# Altium project POW_HugoHamblok_Final.PrjPcb
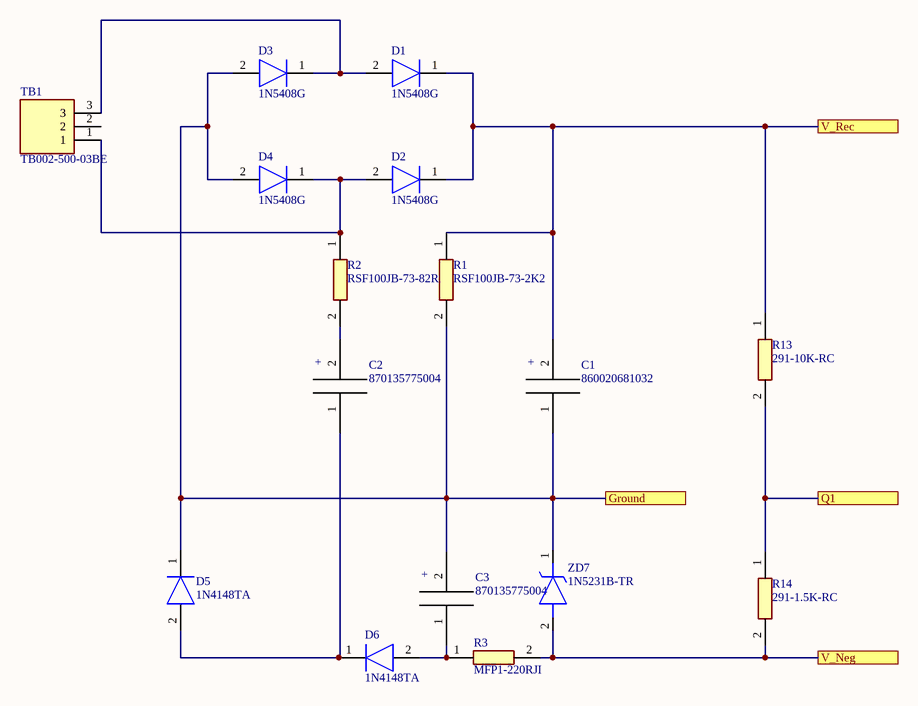
[diagram p0: POW_Schematic1.SchDoc]
4 sheets, 55 parts. Net scope: flat (ports and power ports of the same name join across sheets).
Board file: POW_PCB.PcbDoc
Sheets:
  POW_Schematic1.SchDoc
  POW_Schematic2.SchDoc
  POW_Schematic3.SchDoc
  POW_Schematic4.SchDoc

## Sheet POW_Schematic1.SchDoc
size A4

### Parts
C1  860020681032  [860020681032]
C2  870135775004  [870135775004]
C3  870135775004  [870135775004]
D1  1N5408G  [DIOAD2860W130L840D505]
D2  1N5408G  [DIOAD2860W130L840D505]
D3  1N5408G  [DIOAD2860W130L840D505]
D4  1N5408G  [DIOAD2860W130L840D505]
D5  1N4148TA  [DIOAD1068W53L380D172]
D6  1N4148TA  [DIOAD1068W53L380D172]
R1  RSF100JB-73-2K2  [RSF100 Style Footprint]
R2  RSF100JB-73-82R  [RSF100 Style Footprint]
R3  MFP1-220RJI  [MFP1-220RJI]
R13  291-10K-RC  [291-XXX-RC-Type]
R14  291-1.5K-RC  [291-XXX-RC-Type]
TB1  TB002-500-03BE  [SHDR3W100P0X500_1X3_1500X760X1000P]
ZD7  1N5231B-TR  [DIOAD990W55L350D160]

### Ports
Ground, Q1, V_Neg, V_Rec

### Nets
NetC1_1: C1.1 C3.2 D3.2(A) D4.2(A) D5.1(K) R1.2 ZD7.1(K) ; port Ground
NetC1_2: C1.2 D1.1(K) D2.1(K) R1.1 R13.1 ; port V_Rec
NetC2_1: C2.1 D5.2(A) D6.1(K)
NetC2_2: C2.2 R2.2
NetC3_1: C3.1 D6.2(A) R3.1
NetD1_2: D1.2(A) D3.1(K) TB1.3
NetD2_2: D2.2(A) D4.1(K) R2.1 TB1.1
NetIC2_4: R3.2 R14.2 ZD7.2(A) ; port V_Neg
NetR13_2: R13.2 R14.1 ; port Q1

Not connected (* = marked no-connect by the designer): TB1 2

### Notes on the sheet
- (in symbol 860020681032) +
- (in symbol 870135775004) +

### Library data of the parts
C1 = 860020681032: Capacitor 3300uF 50V
C2 C3 = 870135775004: Capacitor 47uF 50V
D1-D4 = 1N5408G: Diode; Manufacturer_Name: ON Semiconductor; Allied_Number: 70099678; Datasheet Link: http://www.onsemi.com/pub/Collateral/1N5400-D.PDF; Manufacturer_Part_Number: 1N5408G; Mouser Part Number: 863-1N5408G; Mouser Price/Stock: https://www.mouser.com/Search/Refine.aspx?Keyword=863-1N5408G; RS Part Number: 7743344P; RS Price/Stock: http://uk.rs-online.com/web/p/products/7743344P; Allied Price/Stock: http://www.alliedelec.com/on-semiconductor-1n5408g/70099678/
D5 D6 = 1N4148TA: Diode; Manufacturer_Name: ON Semiconductor; Datasheet Link: https://www.fairchildsemi.com/datasheets/1N/1N914.pdf; Manufacturer_Part_Number: 1N4148TA; Mouser Part Number: 512-1N4148TA; Mouser Price/Stock: https://www.mouser.com/Search/Refine.aspx?Keyword=512-1N4148TA; RS Part Number: 7390290P; RS Price/Stock: http://uk.rs-online.com/web/p/products/7390290P
R1 = RSF100JB-73-2K2: Resistor 1W 2.2K Ohm 5%; Manufacturer_Name: YAGEO (PHYCOMP); Datasheet Link: https://www.mouser.com/datasheet/2/447/Yageo LR_RSF_2013-594715.pdf; Manufacturer_Part_Number: RSF100JB-73-2K2; Mouser Part Number: 603-RSF100JB-73-2K2; Mouser Price/Stock: https://www.mouser.com/Search/Refine.aspx?Keyword=603-RSF100JB-73-2K2
R2 = RSF100JB-73-82R: Resistor 1W 82 Ohm 5%
R3 = MFP1-220RJI: Resistor 220 ohm 5% 1W
TB1 = TB002-500-03BE: Connector; Manufacturer_Name: CUI Devices; Datasheet Link: https://www.cuidevices.com/product/resource/tb002-500.pdf; Height: 10mm; Manufacturer_Part_Number: TB002-500-03BE; Mouser Part Number: 490-TB002-500-03BE; Mouser Price/Stock: https://www.mouser.com/Search/Refine.aspx?Keyword=490-TB002-500-03BE
ZD7 = 1N5231B-TR: Zener Diode; Manufacturer_Name: Vishay; Allied_Number: 70061636; Datasheet Link: http://www.vishay.com/docs/85588/1n5221.pdf; Manufacturer_Part_Number: 1N5231B-TR; Mouser Part Number: 78-1N5231B; Mouser Price/Stock: https://www.mouser.com/Search/Refine.aspx?Keyword=78-1N5231B; RS Part Number: 8115967P; RS Price/Stock: http://uk.rs-online.com/web/p/products/8115967P; Allied Price/Stock: https://www.alliedelec.com/vishay-smallsignal-optoproducts-ssp-1n5231b-tr/70061636/

## Sheet POW_Schematic2.SchDoc
size A4
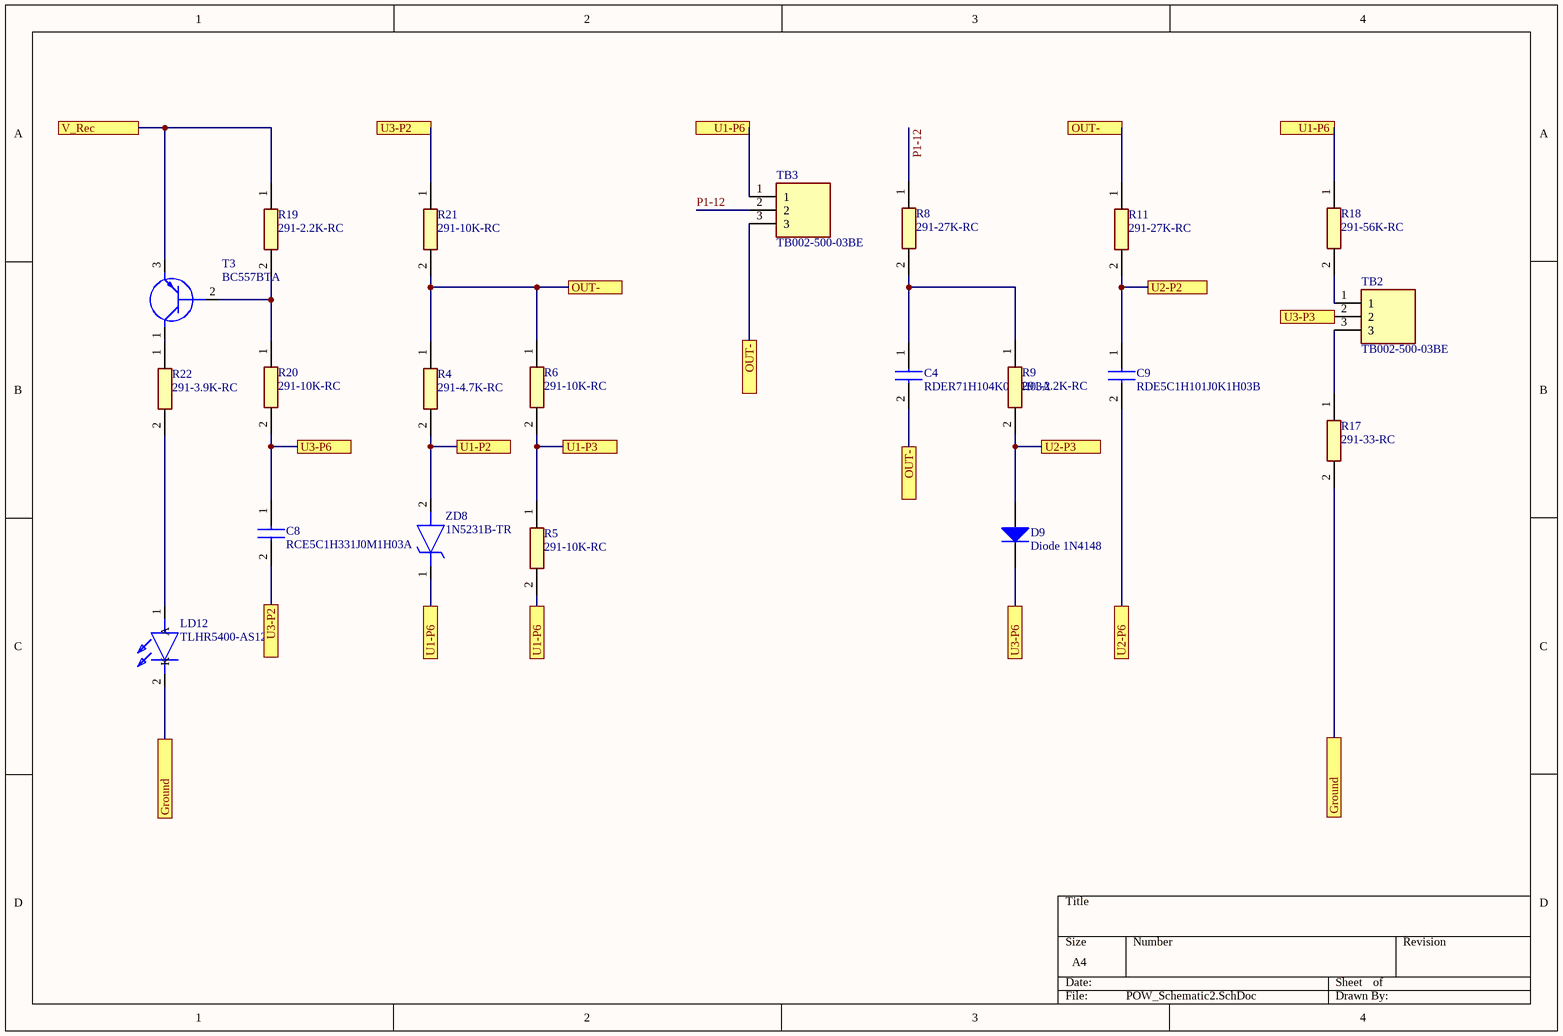
[diagram p1: POW_Schematic2.SchDoc]

### Parts
C4  RDER71H104K0S1H03A  [RDE5C1H100J0P1H03B]
C8  RCE5C1H331J0M1H03A  [RCE5C1H100J0A2H03B]
C9  RDE5C1H101J0K1H03B  [RCE5C1H103J1A2H03B]
D9  Diode 1N4148  [DO-35]
LD12  TLHR5400-AS12Z  [TLHR5400AS12Z]
R4  291-4.7K-RC  [291-XXX-RC-Type]
R5  291-10K-RC  [291-XXX-RC-Type]
R6  291-10K-RC  [291-XXX-RC-Type]
R8  291-27K-RC  [291-XXX-RC-Type]
R9  291-2.2K-RC  [291-XXX-RC-Type]
R11  291-27K-RC  [291-XXX-RC-Type]
R17  291-33-RC  [291-XXX-RC-Type]
R18  291-56K-RC  [291-XXX-RC-Type]
R19  291-2.2K-RC  [291-XXX-RC-Type]
R20  291-10K-RC  [291-XXX-RC-Type]
R21  291-10K-RC  [291-XXX-RC-Type]
R22  291-3.9K-RC  [291-XXX-RC-Type]
T3  BC557BTA  [TO260P419X476X877-3P]
TB2  TB002-500-03BE  [SHDR3W100P0X500_1X3_1500X760X1000P]
TB3  TB002-500-03BE  [SHDR3W100P0X500_1X3_1500X760X1000P]
ZD8  1N5231B-TR  [DIOAD990W55L350D160]

### Ports
Ground, OUT-, U1-P2, U1-P3, U1-P6, U2-P2, U2-P3, U2-P6, U3-P2, U3-P3, U3-P6, V_Rec

### Nets
P1-12: R8.1 TB3.2
NetC1_1: LD12.2(K) R17.2 ; port Ground
NetC1_2: R19.1 T3.3(E) ; port V_Rec
NetC4_1: C4.1 R8.2 R9.1
NetC4_2: C4.2 R4.1 R6.1 R11.1 R21.2 TB3.3 ; port OUT-
NetC6_1: C9.1 R11.2 ; port U2-P2
NetC8_1: C8.1 D9.2(K) R20.2 ; port U3-P6
NetC8_2: C8.2 R21.1 ; port U3-P2
NetC9_2: C9.2 ; port U2-P6
NetD9_1: D9.1(A) R9.2 ; port U2-P3
NetIC1_2: R4.2 ZD8.2(A) ; port U1-P2
NetIC1_3: R5.1 R6.2 ; port U1-P3
NetIC1_6: R5.2 R18.1 TB3.1 ZD8.1(K) ; port U1-P6
NetIC3_3: TB2.2 ; port U3-P3
NetLD12_1: LD12.1(A) R22.2
NetR17_1: R17.1 TB2.3
NetR18_2: R18.2 TB2.1
NetR19_2: R19.2 R20.1 T3.2(B)
NetR22_1: R22.1 T3.1(C)

### Library data of the parts
C4 = RDER71H104K0S1H03A: Capacitor; Manufacturer_Name: Murata Electronics; Datasheet Link: https://psearch.en.murata.com/capacitor/product/RDER71H104K0S1H03A.html; Height: 6mm; Manufacturer_Part_Number: RDER71H104K0S1H03A; Mouser Part Number: 81-RDER71H104K0S1H3A; Mouser Price/Stock: https://www.mouser.com/Search/Refine.aspx?Keyword=81-RDER71H104K0S1H3A
C8 = RCE5C1H331J0M1H03A: Capacitor; Manufacturer_Name: Murata Electronics; Datasheet Link: https://psearch.en.murata.com/capacitor/product/RCE5C1H331J0M1H03A.html; Height: 5mm; Manufacturer_Part_Number: RCE5C1H331J0M1H03A
C9 = RDE5C1H101J0K1H03B: Capacitor; Manufacturer_Name: Murata Electronics; Datasheet Link: https://psearch.en.murata.com/capacitor/product/RDE5C1H101J0K1H03B.html; Height: 5mm; Manufacturer_Part_Number: RDE5C1H101J0K1H03B; Mouser Part Number: 81-RDE5C1H101J0K1H3B; Mouser Price/Stock: https://www.mouser.com/Search/Refine.aspx?Keyword=81-RDE5C1H101J0K1H3B
D9 = Diode 1N4148: High Conductance Fast Diode; Published: 8-Jun-2000; LatestRevisionDate: 17-Jul-2002; LatestRevisionNote: Re-released for DXP Platform.; DatasheetVersion: 1997; PackageReference: DO-35; Publisher: Altium Limited; PackageDescription: Diode, Axial; Body 3.8 x 1.9 mm (LxDia. max), Lead Dia. 0.53 mm (max); Code_JEDEC: DO-204-AH; ComponentLink1Description: Manufacturer Link; ComponentLink1URL: http://www.fairchildsemi.com/; ComponentLink2Description: Datasheet; ComponentLink2URL: http://www.fairchildsemi.com/ds/1N%2F1N4148.pdf
LD12 = TLHR5400-AS12Z: LED; Manufacturer_Name: Vishay; Datasheet Link: http://www.vishay.com/docs/83012/tlhg540.pdf; Height: 12.8mm; Manufacturer_Part_Number: TLHR5400-AS12Z; Mouser Part Number: 78-TLHR5400-AS12Z; Mouser Price/Stock: https://www.mouser.com/Search/Refine.aspx?Keyword=78-TLHR5400-AS12Z
T3 = BC557BTA: Transistor BJT PNP; Manufacturer_Name: ON Semiconductor; Datasheet Link: https://componentsearchengine.com/Datasheets/2/BC557BTA.pdf; Height: 4.19mm; Manufacturer_Part_Number: BC557BTA; Mouser Part Number: 512-BC557BTA; Mouser Price/Stock: https://www.mouser.com/Search/Refine.aspx?Keyword=512-BC557BTA; RS Part Number: 7613505P; RS Price/Stock: http://uk.rs-online.com/web/p/products/7613505P
TB2 TB3 = TB002-500-03BE: as TB1 on sheet POW_Schematic1; Datasheet Link: https://www.cuidevices.com/product/resource/tb002-500.pdf; Height: 10mm; Manufacturer_Part_Number: TB002-500-03BE; Mouser Part Number: 490-TB002-500-03BE; Mouser Price/Stock: https://www.mouser.com/Search/Refine.aspx?Keyword=490-TB002-500-03BE
ZD8 = 1N5231B-TR: as ZD7 on sheet POW_Schematic1; Datasheet Link: http://www.vishay.com/docs/85588/1n5221.pdf; Manufacturer_Part_Number: 1N5231B-TR; Mouser Part Number: 78-1N5231B; Mouser Price/Stock: https://www.mouser.com/Search/Refine.aspx?Keyword=78-1N5231B; RS Part Number: 8115967P; RS Price/Stock: http://uk.rs-online.com/web/p/products/8115967P; Allied Price/Stock: https://www.alliedelec.com/vishay-smallsignal-optoproducts-ssp-1n5231b-tr/70061636/

## Sheet POW_Schematic3.SchDoc
size A4
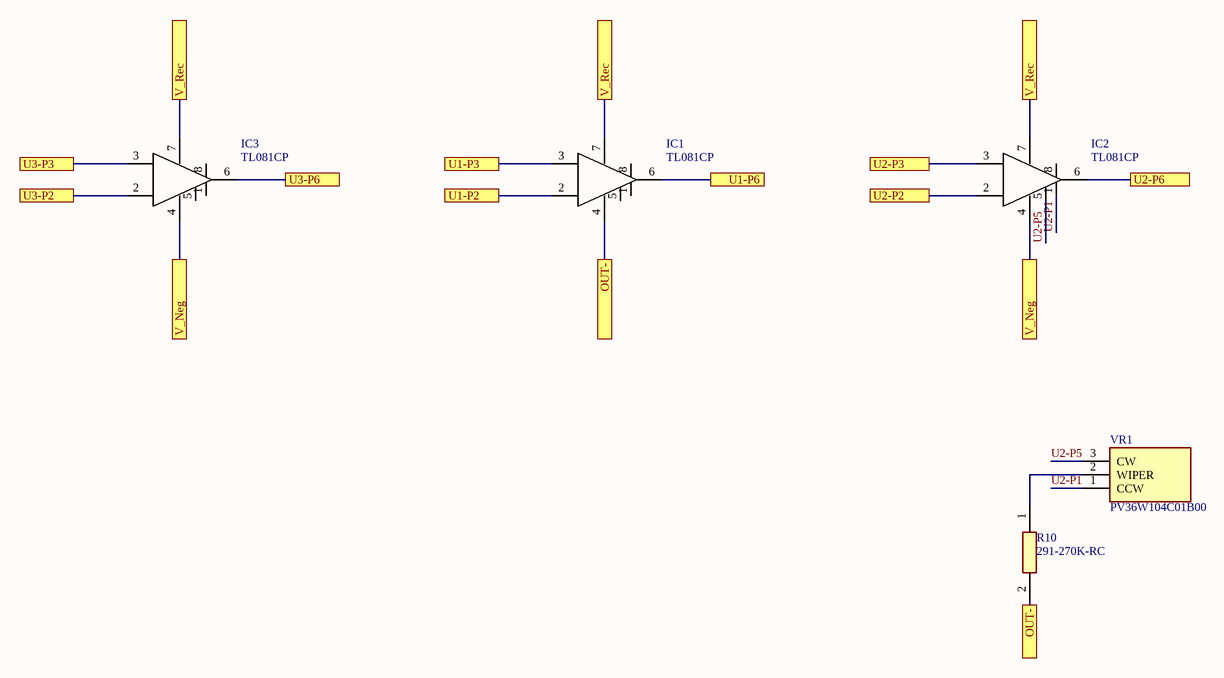
[diagram p2: POW_Schematic3.SchDoc]

### Parts
IC1  TL081CP  [DIP794W53P254L959H508Q8N]
IC2  TL081CP  [DIP794W53P254L959H508Q8N]
IC3  TL081CP  [DIP794W53P254L959H508Q8N]
R10  291-270K-RC  [291-XXX-RC-Type]
VR1  PV36W104C01B00  [PV36W]

### Ports
OUT-, U1-P2, U1-P3, U1-P6, U2-P2, U2-P3, U2-P6, U3-P2, U3-P3, U3-P6, V_Neg, V_Rec

### Nets
U2-P1: IC2.1 VR1.1(CCW)
U2-P5: IC2.5 VR1.3(CW)
NetC1_2: IC1.7 IC2.7 IC3.7 ; port V_Rec
NetC4_2: IC1.4 R10.2 ; port OUT-
NetC6_1: IC2.2 ; port U2-P2
NetC8_1: IC3.6 ; port U3-P6
NetC8_2: IC3.2 ; port U3-P2
NetC9_2: IC2.6 ; port U2-P6
NetD9_1: IC2.3 ; port U2-P3
NetIC1_2: IC1.2 ; port U1-P2
NetIC1_3: IC1.3 ; port U1-P3
NetIC1_6: IC1.6 ; port U1-P6
NetIC2_4: IC2.4 IC3.4 ; port V_Neg
NetIC3_3: IC3.3 ; port U3-P3
NetR10_1: R10.1 VR1.2(WIPER)

Not connected (* = marked no-connect by the designer): IC1 1 5 8; IC2 8; IC3 1 5 8

### Library data of the parts
IC1-IC3 = TL081CP: Integrated Circuit; Manufacturer_Name: Texas Instruments; Datasheet Link: http://www.ti.com/lit/ds/symlink/tl081a.pdf; Height: 5.08mm; Manufacturer_Part_Number: TL081CP; Mouser Part Number: 595-TL081CP; Mouser Price/Stock: https://www.mouser.com/Search/Refine.aspx?Keyword=595-TL081CP; RS Part Number: 0304223P; RS Price/Stock: http://uk.rs-online.com/web/p/products/0304223P
VR1 = PV36W104C01B00: Variable Resistor; Manufacturer_Name: Bourns; Allied_Number: 71024705; Datasheet Link: https://www.bourns.com/docs/Product-Datasheets/pv36.pdf; Manufacturer_Part_Number: PV36W104C01B00; Mouser Part Number: 81-PV36W104C01B00; Mouser Price/Stock: https://www.mouser.com/Search/Refine.aspx?Keyword=81-PV36W104C01B00; RS Part Number: 7692160P; RS Price/Stock: http://uk.rs-online.com/web/p/products/7692160P; Allied Price/Stock: https://www.alliedelec.com/bourns-pv36w104c01b00/71024705/

## Sheet POW_Schematic4.SchDoc
size A4
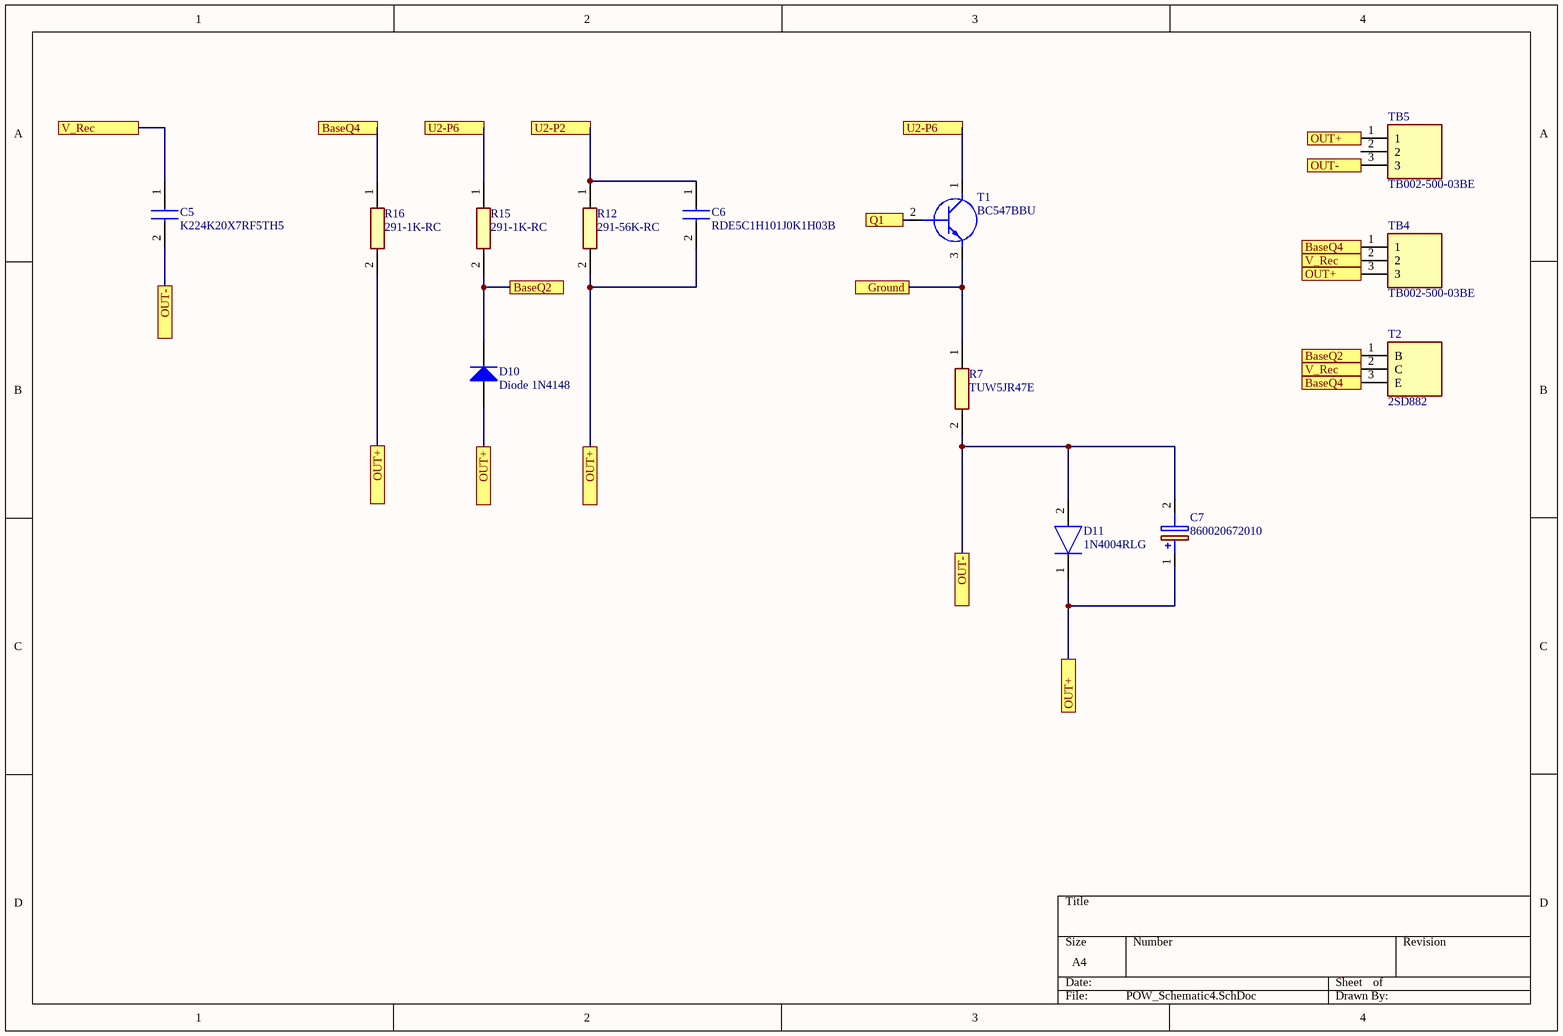
[diagram p3: POW_Schematic4.SchDoc]

### Parts
C5  K224K20X7RF5TH5  [K224K20X7RF5TH5]
C6  RDE5C1H101J0K1H03B  [RCE5C1H103J1A2H03B]
C7  860020672010  [CAPPRD200W52D500H1250]
D10  Diode 1N4148  [DO-35]
D11  1N4004RLG  [DIOAD1405W86L465D235]
R7  TUW5JR47E  [TUW5JR47E]
R12  291-56K-RC  [291-XXX-RC-Type]
R15  291-1K-RC  [291-XXX-RC-Type]
R16  291-1K-RC  [291-XXX-RC-Type]
T1  BC547BBU  [SS9018HBU]
T2  2SD882  [TO254P290X760X1320-3P]
TB4  TB002-500-03BE  [SHDR3W100P0X500_1X3_1500X760X1000P]
TB5  TB002-500-03BE  [SHDR3W100P0X500_1X3_1500X760X1000P]

### Ports
BaseQ2, BaseQ4, Ground, OUT+, OUT-, Q1, U2-P2, U2-P6, V_Rec

### Nets
NetC1_1: R7.1 T1.3(E) ; port Ground
NetC1_2: C5.1 T2.2(C) TB4.2 ; port V_Rec
NetC4_2: C5.2 C7.2(-) D11.2(A) R7.2 TB5.3 ; port OUT-
NetC6_1: C6.1 R12.1 ; port U2-P2
NetC6_2: C6.2 C7.1(+) D10.1(A) D11.1(K) R12.2 R16.2 TB4.3 TB5.1 ; port OUT+
NetC9_2: R15.1 T1.1(C) ; port U2-P6
NetD10_2: D10.2(K) R15.2 T2.1(B) ; port BaseQ2
NetR13_2: T1.2(B) ; port Q1
NetR16_1: R16.1 T2.3(E) TB4.1 ; port BaseQ4

Not connected (* = marked no-connect by the designer): TB5 2

### Library data of the parts
C5 = K224K20X7RF5TH5: Capacitor; Manufacturer_Name: Vishay; Allied_Number: 70122947; Datasheet Link: http://www.vishay.com/docs/45171/kseries.pdf; Height: 5mm; Manufacturer_Part_Number: K224K20X7RF5TH5; Mouser Part Number: 594-K224K20X7RF5TH5; Mouser Price/Stock: https://www.mouser.com/Search/Refine.aspx?Keyword=594-K224K20X7RF5TH5; RS Part Number: 8523328; RS Price/Stock: http://uk.rs-online.com/web/p/products/8523328; Allied Price/Stock: https://www.alliedelec.com/bccomponents-vishay-k224k20x7rf5th5/70122947/
C6 = RDE5C1H101J0K1H03B: as C9 on sheet POW_Schematic2; Datasheet Link: https://psearch.en.murata.com/capacitor/product/RDE5C1H101J0K1H03B.html; Height: 5mm; Manufacturer_Part_Number: RDE5C1H101J0K1H03B; Mouser Part Number: 81-RDE5C1H101J0K1H3B; Mouser Price/Stock: https://www.mouser.com/Search/Refine.aspx?Keyword=81-RDE5C1H101J0K1H3B
C7 = 860020672010: Capacitor Polarised; Manufacturer_Name: Wurth Elektronik; Datasheet Link: https://katalog.we-online.de/pbs/datasheet/860020672010.pdf; Height: 12.5mm; Manufacturer_Part_Number: 860020672010; Mouser Part Number: 710-860020672010; Mouser Price/Stock: https://www.mouser.com/Search/Refine.aspx?Keyword=710-860020672010; RS Part Number: 8396621P; RS Price/Stock: http://uk.rs-online.com/web/p/products/8396621P
D10 = Diode 1N4148: High Conductance Fast Diode; Published: 8-Jun-2000; LatestRevisionDate: 17-Jul-2002; LatestRevisionNote: Re-released for DXP Platform.; DatasheetVersion: 1997; PackageReference: DO-35; Publisher: Altium Limited; PackageDescription: Diode, Axial; Body 3.8 x 1.9 mm (LxDia. max), Lead Dia. 0.53 mm (max); Code_JEDEC: DO-204-AH; ComponentLink1Description: Manufacturer Link; ComponentLink1URL: http://www.fairchildsemi.com/; ComponentLink2Description: Datasheet; ComponentLink2URL: http://www.fairchildsemi.com/ds/1N%2F1N4148.pdf
D11 = 1N4004RLG: Diode; Manufacturer_Name: ON Semiconductor; Datasheet Link: http://www.onsemi.com/pub/Collateral/1N4001-D.PDF; Manufacturer_Part_Number: 1N4004RLG; Mouser Part Number: 863-1N4004RLG; Mouser Price/Stock: https://www.mouser.com/Search/Refine.aspx?Keyword=863-1N4004RLG; RS Part Number: 1844627P; RS Price/Stock: http://uk.rs-online.com/web/p/products/1844627P
R7 = TUW5JR47E: Resistor; Manufacturer_Name: Ohmite; Allied_Number: 70024726; Datasheet Link: https://componentsearchengine.com/Datasheets/2/TUW5JR47E.pdf; Manufacturer_Part_Number: TUW5JR47E; Mouser Part Number: 588-TUW5JR47E; Mouser Price/Stock: https://www.mouser.com/Search/Refine.aspx?Keyword=588-TUW5JR47E; RS Part Number: 8934166; RS Price/Stock: http://uk.rs-online.com/web/p/products/8934166; Allied Price/Stock: https://www.alliedelec.com/ohmite-tuw5jr47e/70024726/
T1 = BC547BBU: Transistor BJT NPN; Manufacturer_Name: ON Semiconductor; Datasheet Link: http://www.onsemi.com/pub/Collateral/BC550-D.pdf; Manufacturer_Part_Number: BC547BBU; Mouser Part Number: 512-BC547BBU; Mouser Price/Stock: https://www.mouser.com/Search/Refine.aspx?Keyword=512-BC547BBU; RS Part Number: 8031083P; RS Price/Stock: http://uk.rs-online.com/web/p/products/8031083P
T2 = 2SD882: Integrated Circuit; Manufacturer_Name: STMicroelectronics; Allied_Number: 70389765; Datasheet Link: http://www.st.com/web/en/resource/technical/document/datasheet/CD00062867.pdf; Height: 2.9mm; Manufacturer_Part_Number: 2SD882; Mouser Part Number: 511-2SD882; Mouser Price/Stock: https://www.mouser.com/Search/Refine.aspx?Keyword=511-2SD882; RS Part Number: 6868045P; RS Price/Stock: http://uk.rs-online.com/web/p/products/6868045P; Allied Price/Stock: http://www.alliedelec.com/stmicroelectronics-2sd882/70389765/
TB4 TB5 = TB002-500-03BE: as TB1 on sheet POW_Schematic1; Datasheet Link: https://www.cuidevices.com/product/resource/tb002-500.pdf; Height: 10mm; Manufacturer_Part_Number: TB002-500-03BE; Mouser Part Number: 490-TB002-500-03BE; Mouser Price/Stock: https://www.mouser.com/Search/Refine.aspx?Keyword=490-TB002-500-03BE

## Nets that join several sheets
NetC1_1: POW_Schematic1 (7 pins), POW_Schematic2 (LD12.2 R17.2), POW_Schematic4 (R7.1 T1.3)
NetC1_2: POW_Schematic1 (5 pins), POW_Schematic2 (R19.1 T3.3), POW_Schematic3 (IC1.7 IC2.7 IC3.7), POW_Schematic4 (C5.1 T2.2 TB4.2)
NetC4_2: POW_Schematic2 (6 pins), POW_Schematic3 (IC1.4 R10.2), POW_Schematic4 (5 pins)
NetC6_1: POW_Schematic2 (C9.1 R11.2), POW_Schematic3 (IC2.2), POW_Schematic4 (C6.1 R12.1)
NetC8_1: POW_Schematic2 (C8.1 D9.2 R20.2), POW_Schematic3 (IC3.6)
NetC8_2: POW_Schematic2 (C8.2 R21.1), POW_Schematic3 (IC3.2)
NetC9_2: POW_Schematic2 (C9.2), POW_Schematic3 (IC2.6), POW_Schematic4 (R15.1 T1.1)
NetD9_1: POW_Schematic2 (D9.1 R9.2), POW_Schematic3 (IC2.3)
NetIC1_2: POW_Schematic2 (R4.2 ZD8.2), POW_Schematic3 (IC1.2)
NetIC1_3: POW_Schematic2 (R5.1 R6.2), POW_Schematic3 (IC1.3)
NetIC1_6: POW_Schematic2 (R5.2 R18.1 TB3.1 ZD8.1), POW_Schematic3 (IC1.6)
NetIC2_4: POW_Schematic1 (R3.2 R14.2 ZD7.2), POW_Schematic3 (IC2.4 IC3.4)
NetIC3_3: POW_Schematic2 (TB2.2), POW_Schematic3 (IC3.3)
NetR13_2: POW_Schematic1 (R13.2 R14.1), POW_Schematic4 (T1.2)